# Altium schematic sheet TLCDDisplay.SchDoc: LiveDesign Evaluation - Stop Watch
size A3; Organization: Altium Limited; Address1: L3, 12a Rodborough Rd; Address2: Frenchs Forest; Address3: NSW; Address4: Australia 2086; DocumentNumber: 6; SheetNumber: 6; SheetTotal: 7
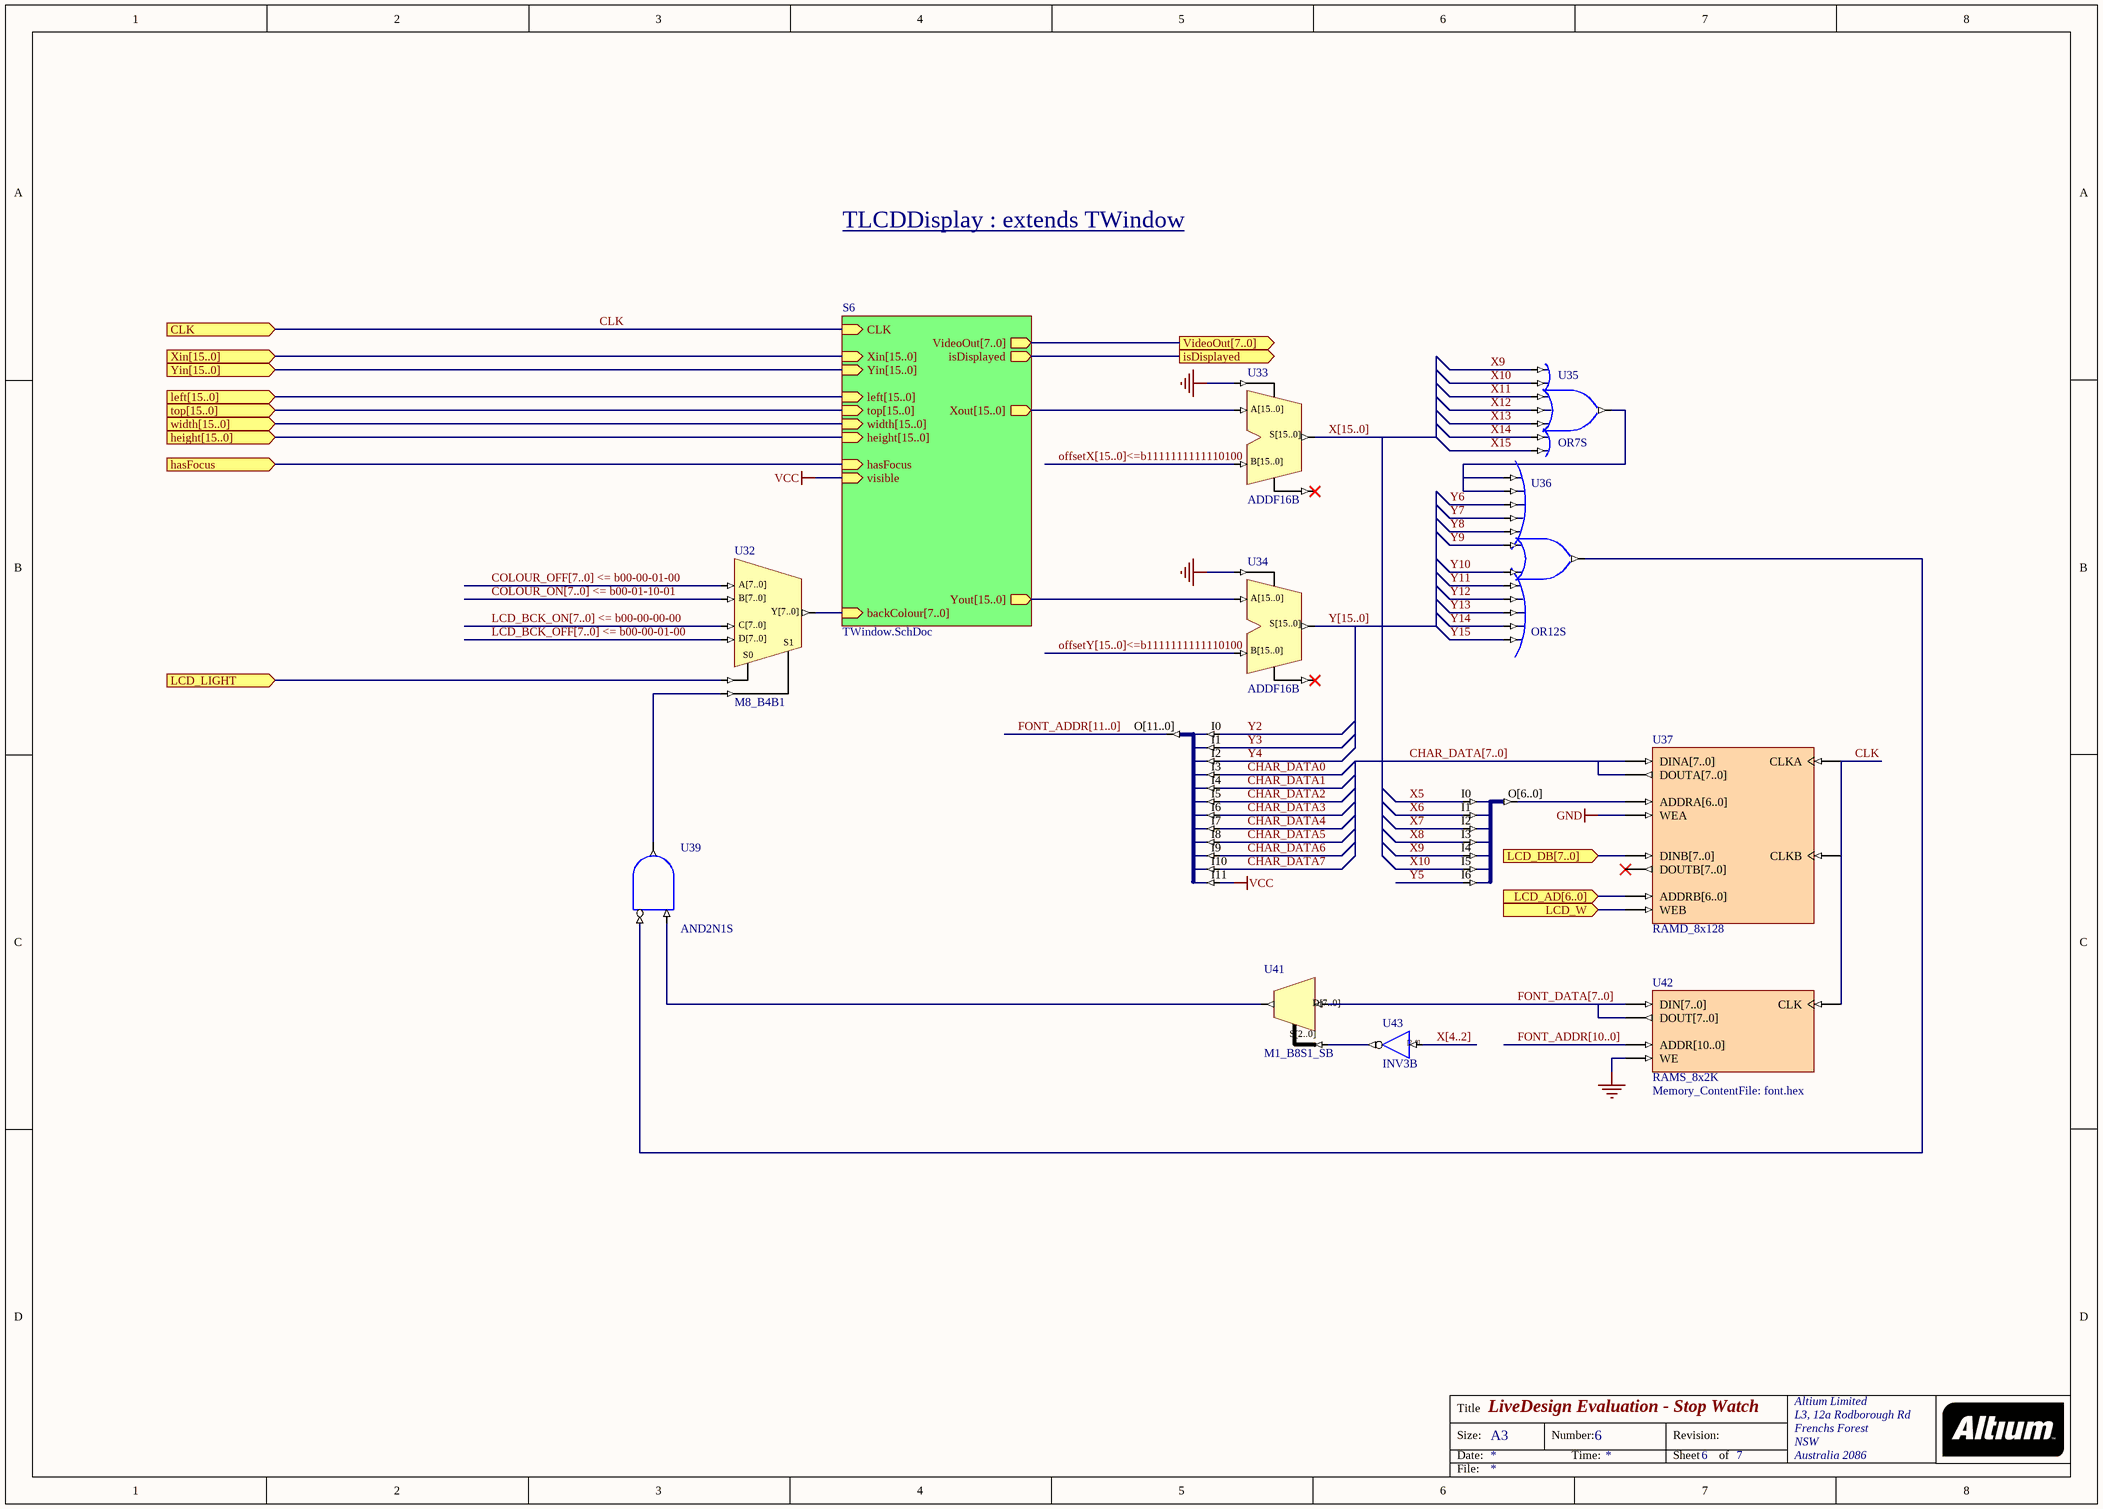
[diagram p0: TLCDDisplay.SchDoc]

## Parts
U32  M8_B4B1
U33  ADDF16B
U34  ADDF16B
U35  OR7S
U36  OR12S
U37  RAMD_8x128
U38  J7S_7B  (value not drawn)
U39  AND2N1S
U40  J12S_12B  (value not drawn)
U41  M1_B8S1_SB
U42  RAMS_8x2K  Memory_ContentFile: font.hex
U43  INV3B

## Sub-sheets
S6 = TWindow.SchDoc: CLK (in), VideoOut[7..0] (out), Xin[15..0] (in), Yin[15..0] (in), top[15..0] (in), width[15..0] (in), height[15..0] (in), left[15..0] (in), Xout[15..0] (out), Yout[15..0] (out), backColour[7..0] (in), isDisplayed (out), visible (in), hasFocus (in)

## Ports
CLK (in), hasFocus (in), height[15..0] (in), isDisplayed (out), LCD_AD[6..0] (in), LCD_DB[7..0] (in), LCD_LIGHT (in), LCD_W (in), left[15..0] (in), top[15..0] (in), VideoOut[7..0] (out), width[15..0] (in), Xin[15..0] (in), Yin[15..0] (in)

## Nets
GND: U33.CI U34.CI U37.WEA U42.WE
VCC: U40.I11 ; sheet S6/visible
CHAR_DATA0: U40.I3
CHAR_DATA1: U40.I4
CHAR_DATA2: U40.I5
CHAR_DATA3: U40.I6
CHAR_DATA4: U40.I7
CHAR_DATA5: U40.I8
CHAR_DATA6: U40.I9
CHAR_DATA7: U40.I10
CHAR_DATA[7..0]: U37.DINA[7..0] U37.DOUTA[7..0]
CLK: U37.CLKA U37.CLKB U42.CLK ; port CLK, sheet S6/CLK
COLOUR_OFF[7..0] <= b00-00-01-00: U32.A[7..0]
COLOUR_ON[7..0] <= b00-01-10-01: U32.B[7..0]
FONT_ADDR[10..0]: U42.ADDR[10..0]
FONT_ADDR[11..0]: U40.O[11..0]
FONT_DATA[7..0]: U41.D[7..0] U42.DIN[7..0] U42.DOUT[7..0]
hasFocus: port hasFocus, sheet S6/hasFocus
isDisplayed: port isDisplayed, sheet S6/isDisplayed
LCD_AD[6..0]: U37.ADDRB[6..0] ; port LCD_AD[6..0]
LCD_BCK_OFF[7..0] <= b00-00-01-00: U32.D[7..0]
LCD_BCK_ON[7..0] <= b00-00-00-00: U32.C[7..0]
LCD_DB[7..0]: U37.DINB[7..0] ; port LCD_DB[7..0]
LCD_LIGHT: U32.S0 ; port LCD_LIGHT
LCD_W: U37.WEB ; port LCD_W
offsetX[15..0]<=b1111111111110100: U33.B[15..0]
offsetY[15..0]<=b1111111111110100: U34.B[15..0]
X5: U38.I0
X6: U38.I1
X7: U38.I2
X8: U38.I3
X9: U35.I0 U38.I4
X10: U35.I1 U38.I5
X11: U35.I2
X12: U35.I3
X13: U35.I4
X14: U35.I5
X15: U35.I6
X[4..2]: U43.I[2..0]
X[15..0]: U33.S[15..0]
Y2: U40.I0
Y3: U40.I1
Y4: U40.I2
Y5: U38.I6
Y6: U36.I2
Y7: U36.I3
Y8: U36.I4
Y9: U36.I5
Y10: U36.I6
Y11: U36.I7
Y12: U36.I8
Y13: U36.I9
Y14: U36.I10
Y15: U36.I11
Y[15..0]: U34.S[15..0]
NetU32_S1: U32.S1 U39.O
NetU32_Y[7..0]: U32.Y[7..0] ; sheet S6/backColour[7..0]
NetU33_A[15..0]: U33.A[15..0] ; sheet S6/Xout[15..0]
NetU34_A[15..0]: U34.A[15..0] ; sheet S6/Yout[15..0]
NetU35_O: U35.O U36.I0 U36.I1
NetU36_O: U36.O U39.I0
NetU37_ADDRA[6..0]: U37.ADDRA[6..0] U38.O[6..0]
NetU39_I1: U39.I1 U41.O
NetU41_S[2..0]: U41.S[2..0] U43.O[2..0]

Not connected (* = marked no-connect by the designer): U33 CO*; U34 CO*; U37 DOUTB[7..0]*

## Buses and harness runs
bus CHAR_DATA[7..0]
bus COLOUR_OFF[7..0] <= b00-00-01-00
bus COLOUR_ON[7..0] <= b00-01-10-01
bus FONT_ADDR[10..0]
bus FONT_ADDR[11..0]
bus FONT_DATA[7..0]
bus LCD_BCK_OFF[7..0] <= b00-00-01-00
bus LCD_BCK_ON[7..0] <= b00-00-00-00
bus offsetX[15..0]<=b1111111111110100
bus offsetY[15..0]<=b1111111111110100
bus port height[15..0] = sheet S6/height[15..0]
bus port left[15..0] = sheet S6/left[15..0]
bus port top[15..0] = sheet S6/top[15..0]
bus port VideoOut[7..0] = sheet S6/VideoOut[7..0]
bus port width[15..0] = sheet S6/width[15..0]
bus port Xin[15..0] = sheet S6/Xin[15..0]
bus port Yin[15..0] = sheet S6/Yin[15..0]
bus X[4..2]
bus X[15..0]
bus Y[15..0]

## Notes on the sheet
- TLCDDisplay : extends TWindow
- Title
- Size:
- Date:
- A3
- Number:
- Time:
- Revision:
- Sheet
- of
- File:
- (in symbol INV3B) [2..0]

## Library data of the parts
U32 = M8_B4B1: 4x8-Bit Bus to 1x8-Bit Bus Multiplexer; ArchiveName: GENERIC; VHDLIB_SIM: GENERIC_LIB; Published: 29-Jan-2004; Publisher: Altium Limited; Core Revision: 1.00.00
U33 U34 = ADDF16B: 16-Bit Cascadable Unsigned Binary Full Adder, Bus Version; ArchiveName: GENERIC; VHDLIB_SIM: GENERIC_LIB; Published: 31-May-2004; Publisher: Altium Limited; Core Revision: 1.00.00
U35 = OR7S: 7-Input OR Gate, Single Pin Version; Xilinx Equivalent: OR7; ArchiveName: GENERIC; VHDLIB_SIM: GENERIC_LIB; Published: 29-Jan-2004; Publisher: Altium Limited; Core Revision: 1.00.00
U36 = OR12S: 12-Input OR Gate, Single Pin Version; Xilinx Equivalent: OR12; ArchiveName: GENERIC; VHDLIB_SIM: GENERIC_LIB; Published: 29-Jan-2004; Publisher: Altium Limited; Core Revision: 1.00.00
U37 = RAMD_8x128: Dual Port RAM; Memory_DepthA: 128; Memory_Type: RAM_DualPortBlock; Memory_WidthA: 8; Memory_ClockEdge: Rising; Nexus_Core: Memory_Program; Memory_EnablePin: False; Published: 23/04/2004; Publisher: Altium Hobart Technology Center; Memory_DepthB: 128; Memory_WidthB: 8
U38 = J7S_7B: 7 Single pin inputs to single 7-Bit output bus; ArchiveName: GENERIC; VHDLIB_SIM: GENERIC_LIB; Published: 29-Jan-2004; Publisher: Altium Limited; Core Revision: 1.00.00
U39 = AND2N1S: 2-Input AND Gate with Active Low A Input, Single Pin Version; Xilinx Equivalent: AND2B1; ArchiveName: GENERIC; VHDLIB_SIM: GENERIC_LIB; Published: 29-Jan-2004; Publisher: Altium Limited; Core Revision: 1.00.00
U40 = J12S_12B: 12 Single pin inputs to single 12-Bit output bus; ArchiveName: GENERIC; VHDLIB_SIM: GENERIC_LIB; Published: 29-Jan-2004; Publisher: Altium Limited; Core Revision: 1.00.00
U41 = M1_B8S1_SB: 1x8-Bit Bus to 1x1-Single Wire Multiplexer With Bus Version Select; ArchiveName: GENERIC; VHDLIB_SIM: GENERIC_LIB; Published: 31-May-2004; Publisher: Altium Limited; Core Revision: 1.00.00
U42 = RAMS_8x2K: Single Port RAM; Memory_Type: RAM_SinglePortBlock; Memory_ClockEdge: Rising; Nexus_Core: Memory_Program; Memory_Depth: 2048; Memory_Width: 8; Memory_EnablePin: False; Published: 23/04/2004; Publisher: Altium Hobart Technology Center
U43 = INV3B: 3-Bit Inverter, Bus Version; ArchiveName: GENERIC; VHDLIB_SIM: GENERIC_LIB; Published: 29-Jan-2004; Publisher: Altium Limited; Core Revision: 1.00.00